# EAGLE design usb4x1mux (EAGLE 7.5.0)
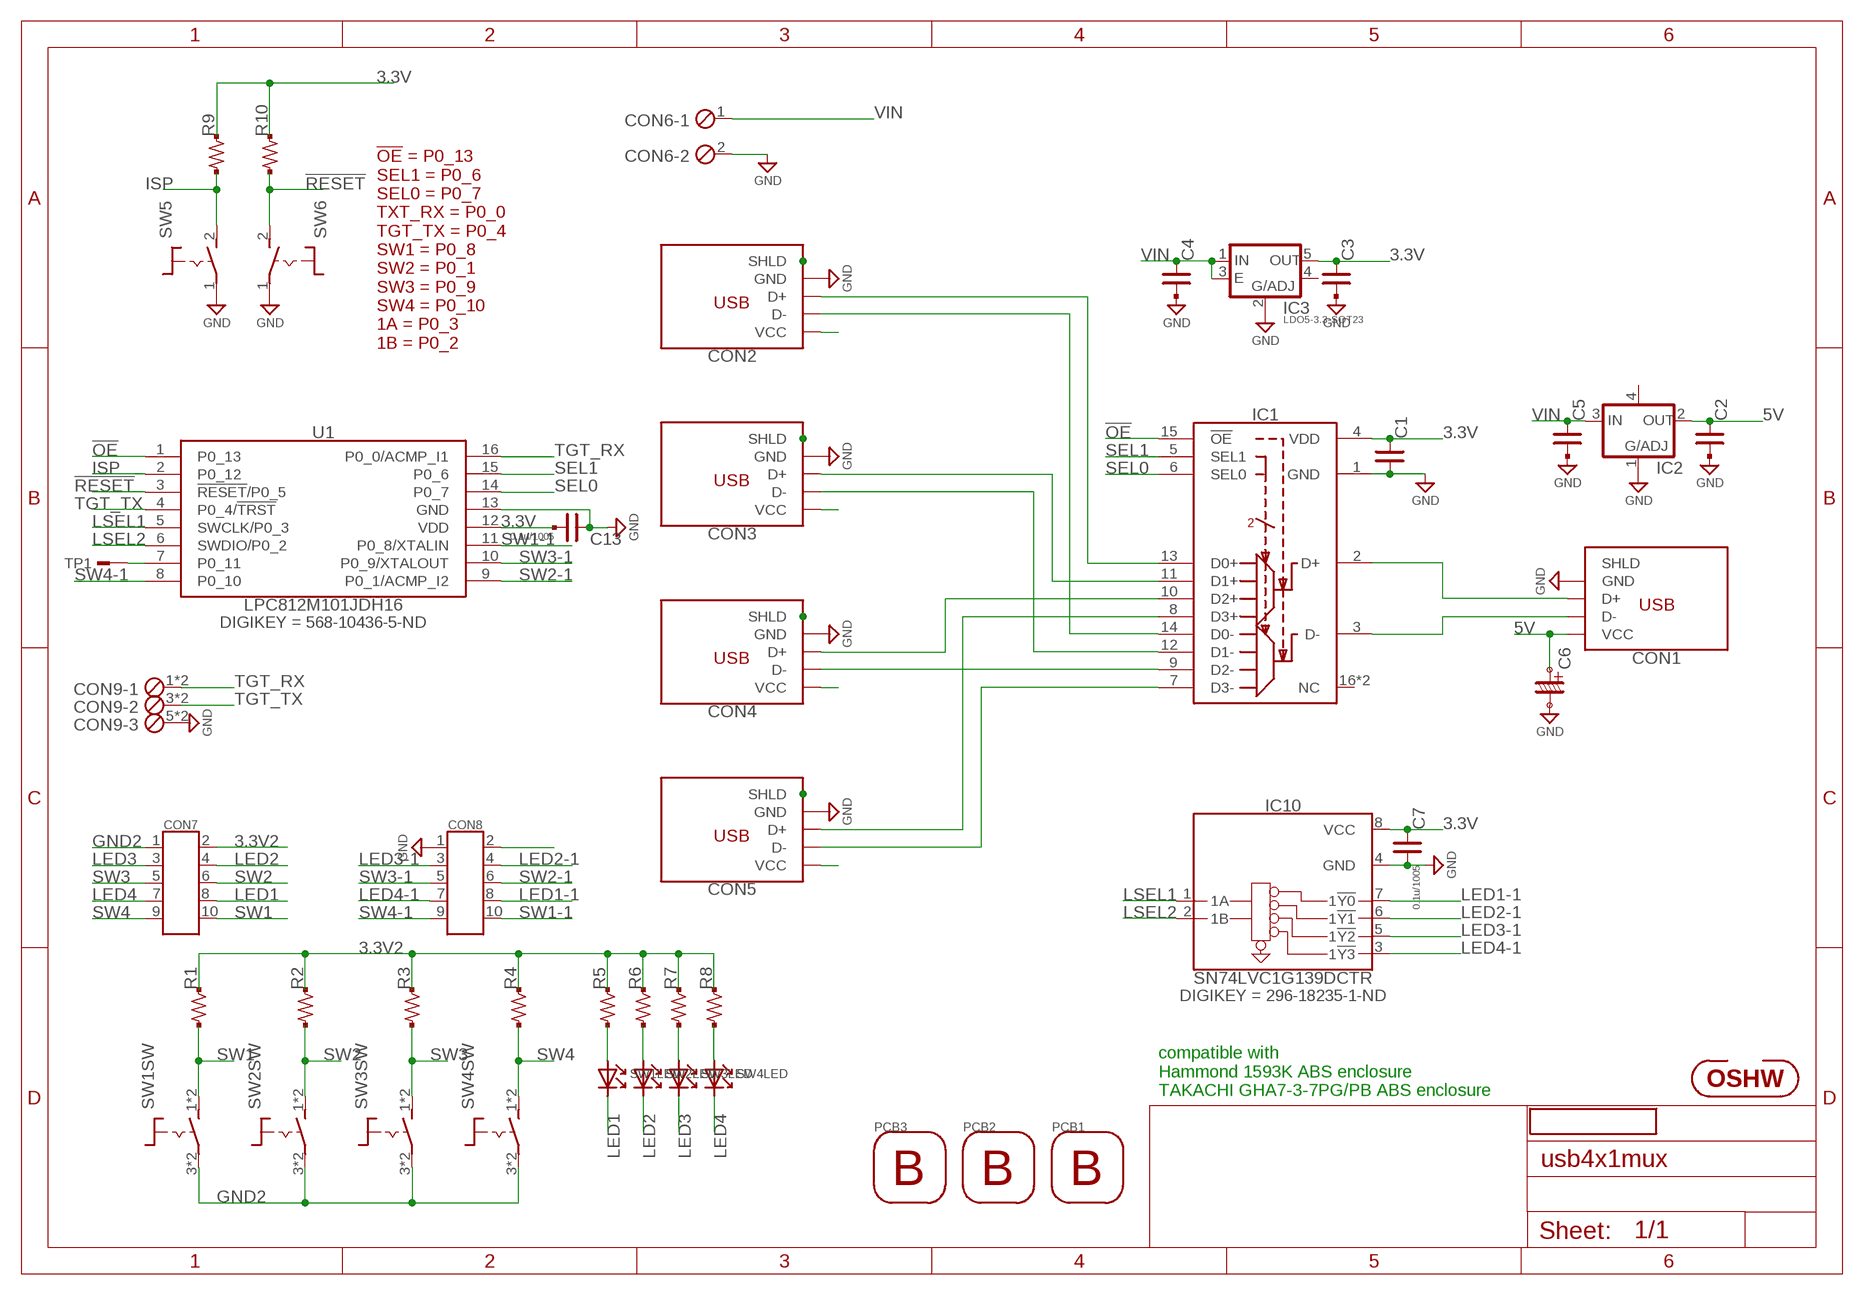
[diagram p0: schematic, sheet 1]

## Parts
C1  C-SMD-0.1U-1608  [CR-1608]
C2  C-SMD-0.1U-1608  [CR-1608]
C3  C-SMD-0.1U-1608  [CR-1608]
C4  C-SMD-10U-1608  [CR-1608]
C5  C-SMD-10U-1608  [CR-1608]
C6  C-DENKAI-100U-875105142005WURTH  [C-2.5PHI5-875105142005WURTH]
C7  0.1u/1005  C-SMD-0.1U-1608  [CR-1608]
C13  0.1u/1005  C-SMD-0.1U-1608  [CR-1608]
CON1  CON-USB-A-614104150121  [CON-USB-614104150121WURTH]
CON2  CON-USB-UB  [CON-USB-47589-0001MOLEX]
CON3  CON-USB-UB  [CON-USB-47589-0001MOLEX]
CON4  CON-USB-UB  [CON-USB-47589-0001MOLEX]
CON5  CON-USB-UB  [CON-USB-47589-0001MOLEX]
CON6  ETB43024B  [ETB43024]
CON7  CON-MIL-10-ARM3  [PH127-2X5MG-1.5]
CON8  CON-MIL-10-ARM3  [PH127-2X5MG-1.5]
CON9  CON-TANSHI3  [CON-FFKV3]
GIT1  GIT-REVISION_1.7  [GIT-REVISION_1.7]
IC1  IC-USB-FSUSB74  [QFN16-0.5P3.0X3.0]
IC2  LDO4-5.0-SOT223  [IC-SOT223]
IC3  LDO5-3.3-SOT23  [SOT95P280X145-5N]
IC10  SN74LVC1G139DCTR  IC-TTL-SINGLE-74-139-FLAT  [SOT65P315X290-8N]
ICON1  ICON-OSHW  [ICON-OSHW]
PCB1  HAMMOND-PCB-BK-1593K  [HAMMOND-1593K]
PCB2  HAMMOND-PCB--66X28  [HAMMOND-1593-28]
PCB3  HAMMOND-PCB--66X28  [HAMMOND-1593-28]
R1  R-US-10K-1608  [R-1608-PADPAD]
R2  R-US-10K-1608  [R-1608-PADPAD]
R3  R-US-10K-1608  [R-1608-PADPAD]
R4  R-US-10K-1608  [R-1608-PADPAD]
R5  R-US-100R-1608  [R-1608-PADPAD]
R6  R-US-100R-1608  [R-1608-PADPAD]
R7  R-US-100R-1608  [R-1608-PADPAD]
R8  R-US-100R-1608  [R-1608-PADPAD]
R9  R-US-100R-1608  [R-1608-PADPAD]
R10  R-US-100R-1608  [R-1608-PADPAD]
SW1  TACTSW2-LED-WH-10SQ  [TS-ALGWRH-G]
SW2  TACTSW2-LED-WH-10SQ  [TS-ALGWRH-G]
SW3  TACTSW2-LED-WH-10SQ  [TS-ALGWRH-G]
SW4  TACTSW2-LED-WH-10SQ  [TS-ALGWRH-G]
SW5  TACTSW2-BK-AKI  [SW-TACTSW-2P]
SW6  TACTSW2-BK-AKI  [SW-TACTSW-2P]
TP1  TESTPAD  [TP06RECT]
U1  LPC812M101JDH16  IC-LPC81X-16-JDH16  [SOT65P510X450X110-16N]

## Nets
3.3V: C1.1 C3.1 C7.1 C13.2 CON8.2 IC1.4(VDD) IC3.5(OUT) IC10.8(VCC) R9.1 R10.1 U1.12(VDD)
3.3V2: CON7.2 R1.1 R2.1 R3.1 R4.1 R5.1 R6.1 R7.1 R8.1
5V: C2.1 C6.+ CON1.1(VCC) IC2.2(OUT)
!OE!: IC1.15(!OE!) U1.1(P0_13)
!RESET!: R10.2 SW6.2(S) U1.3(!RESET!/P0_5)
GND: C1.2 C2.2 C3.2 C4.2 C5.2 C6.- C7.2 C13.1 CON1.4(GND) CON2.5(GND) CON3.5(GND) CON4.5(GND) CON5.5(GND) CON6.2 CON8.1 CON9.5 CON9.6 IC1.1(GND) IC2.1(ADJ) IC3.2(ADJ) IC10.4(GND) SW5.1(P) SW6.1(P) U1.13(GND)
GND2: CON7.1 SW1.3(SW:P) SW1.4(SW:P) SW2.3(SW:P) SW2.4(SW:P) SW3.3(SW:P) SW3.4(SW:P) SW4.3(SW:P) SW4.4(SW:P)
ISP: R9.2 SW5.2(S) U1.2(P0_12)
LED1: CON7.8 SW1.-(LED:K)
LED1-1: CON8.8 IC10.7(1!Y0!)
LED2: CON7.4 SW2.-(LED:K)
LED2-1: CON8.4 IC10.6(1!Y1!)
LED3: CON7.3 SW3.-(LED:K)
LED3-1: CON8.3 IC10.5(1!Y2!)
LED4: CON7.7 SW4.-(LED:K)
LED4-1: CON8.7 IC10.3(1!Y3!)
LSEL1: IC10.1(1A) U1.5(SWCLK/P0_3)
LSEL2: IC10.2(1B) U1.6(SWDIO/P0_2)
N$1: CON2.3(D+) IC1.13(D0+)
N$2: CON2.2(D-) IC1.14(D0-)
N$3: CON3.3(D+) IC1.11(D1+)
N$4: CON3.2(D-) IC1.12(D1-)
N$5: CON4.3(D+) IC1.10(D2+)
N$6: CON4.2(D-) IC1.9(D2-)
N$7: CON5.3(D+) IC1.8(D3+)
N$8: CON5.2(D-) IC1.7(D3-)
N$9: CON1.3(D+) IC1.2(D+)
N$10: CON1.2(D-) IC1.3(D-)
N$11: CON2.1(VCC)
N$12: CON3.1(VCC)
N$13: CON4.1(VCC)
N$14: CON5.1(VCC)
N$15: CON2.SHD$1(SHLD) CON2.SHD$2(SHLD) CON2.SHD$3(SHLD) CON2.SHD$4(SHLD) CON2.SHD$5(SHLD) CON2.SHD$6(SHLD) CON2.SHD$7(SHLD) CON2.SHD(SHLD)
N$16: CON3.SHD$1(SHLD) CON3.SHD$2(SHLD) CON3.SHD$3(SHLD) CON3.SHD$4(SHLD) CON3.SHD$5(SHLD) CON3.SHD$6(SHLD) CON3.SHD$7(SHLD) CON3.SHD(SHLD)
N$17: CON4.SHD$1(SHLD) CON4.SHD$2(SHLD) CON4.SHD$3(SHLD) CON4.SHD$4(SHLD) CON4.SHD$5(SHLD) CON4.SHD$6(SHLD) CON4.SHD$7(SHLD) CON4.SHD(SHLD)
N$18: CON5.SHD$1(SHLD) CON5.SHD$2(SHLD) CON5.SHD$3(SHLD) CON5.SHD$4(SHLD) CON5.SHD$5(SHLD) CON5.SHD$6(SHLD) CON5.SHD$7(SHLD) CON5.SHD(SHLD)
N$23: R5.2 SW1.+(LED:A)
N$24: R6.2 SW2.+(LED:A)
N$25: R7.2 SW3.+(LED:A)
N$26: R8.2 SW4.+(LED:A)
N$69: TP1.TP U1.7(P0_11)
SEL0: IC1.6(SEL0) U1.14(P0_7)
SEL1: IC1.5(SEL1) U1.15(P0_6)
SW1: CON7.10 R1.2 SW1.1(SW:S) SW1.2(SW:S)
SW1-1: CON8.10 U1.11(P0_8/XTALIN)
SW2: CON7.6 R2.2 SW2.1(SW:S) SW2.2(SW:S)
SW2-1: CON8.6 U1.9(P0_1/ACMP_I2)
SW3: CON7.5 R3.2 SW3.1(SW:S) SW3.2(SW:S)
SW3-1: CON8.5 U1.10(P0_9/XTALOUT)
SW4: CON7.9 R4.2 SW4.1(SW:S) SW4.2(SW:S)
SW4-1: CON8.9 U1.8(P0_10)
TGT_RX: CON9.1 CON9.2 U1.16(P0_0/ACMP_I1)
TGT_TX: CON9.3 CON9.4 U1.4(P0_4/!TRST!)
VIN: C4.1 C5.1 CON6.1 IC2.3(IN) IC3.1(IN) IC3.3(E)
Unconnected: CON1.SHLD CON1.SHLD@1(SHLD) IC1.16(NC) IC1.DP(NC) IC2.4(OUT/EN/NC) IC3.4(OUT)

## Notes on the sheet
- !OE! = P0_13
  SEL1 = P0_6
  SEL0 = P0_7
  TXT_RX = P0_0
  TGT_TX = P0_4
  SW1 = P0_8
  SW2 = P0_1
  SW3 = P0_9
  SW4 = P0_10
  1A = P0_3
  1B = P0_2
- compatible with 
  Hammond 1593K ABS enclosure
  TAKACHI GHA7-3-7PG/PB ABS enclosure

## Library data of the parts
C1-C3 C7 C13 = mylib:C-SMD-*: SMD CAPACITOR; AKIZUKI: P-05650; SMD-PAD: 2
C4 C5 = mylib:C-SMD-*: SMD CAPACITOR; DIGIKEY: 445-11238-1-ND; SMD-PAD: 2
C6 = mylib:C-DENKAI-*: Chemical capacitor; DIGIKEY: 732-6394-1-ND; SMD-PAD: 2
CON1 = mylib:CON-USB: USB B CONNECTOR; DIGIKEY: 732-5962-1-ND; MOUSER: 710-614104150121; TH-PAD: 6
CON2-CON5 = mylib:CON-USB: USB B CONNECTOR; DIGIKEY: WM17143CT-ND; SMD-PAD: 11
CON6 = mylib:ETB43024*; AKIZUKI: P-11589
CON7 CON8 = mylib:CON-MIL-10: MIL Box Pinheader : 10Pin; AKIZUKI: C-10904
CON9 = mylib:CON-TANSHI3
GIT1 = git-revision:GIT-REVISION; NOT_COMPONENT: YES
IC1 = mylib:IC-USB-FSUSB74: 4 to 1 USB switch; DIGIKEY: FSUSB74MPXCT-ND; SMD-PAD: 17
IC2 = mylib:LDO4-*: LDO with 4 pins; DIGIKEY: AZ1117EH-5.0TRG1DICT-ND
IC3 = mylib:LDO5-*; AKIZUKI: I-05448; DIGIKEY: 296-35483-1-ND
IC10 = mylib:IC-TTL-SINGLE-74-139: single 74 logic IC: 139; DIGIKEY: 296-18235-1-ND; SMD-PAD: 8
ICON1 = mylib:ICON-OSHW: Silk icon of OSHW; NOT-COMPONENT: YES
PCB1-PCB3 = mylib:HAMMOND-PCB-*
R1-R10 = mylib:R-US-*: SMD resistor Packages : -1608 : 1.6 x 0.8 mm -2125 : 2.0 x 1.25 mm -3216 : 3.2 x 1.6 mm
SW1-SW4 = mylib:TACTSW2-LED-*; AKIZUKI: P-12722
SW5 SW6 = mylib:TACTSW2-*: 2P tact switch; AKIZUKI: P-08078; TH-PAD: 2
TP1 = mylib:TESTPAD: test points; NOT-COMPONENT: YES
U1 = mylib:IC-LPC81X-16: LPC81X microcontroller; DIGIKEY: 568-10436-5-ND; SMD-PAD: 16

## Board
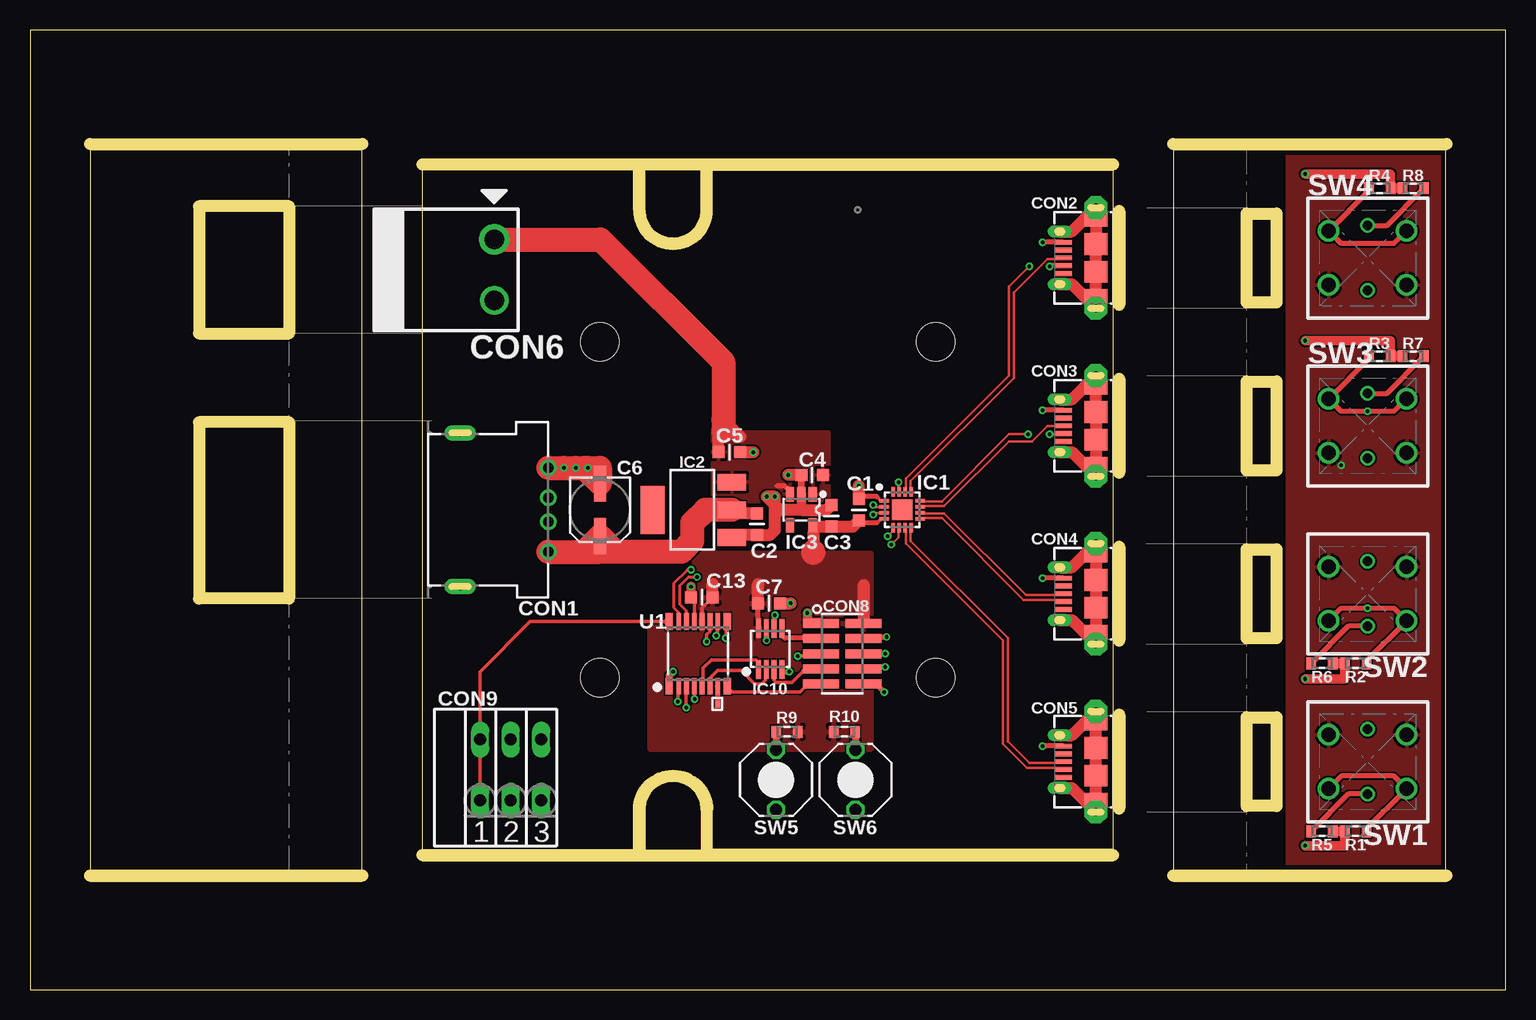
[diagram p1: board, top side]
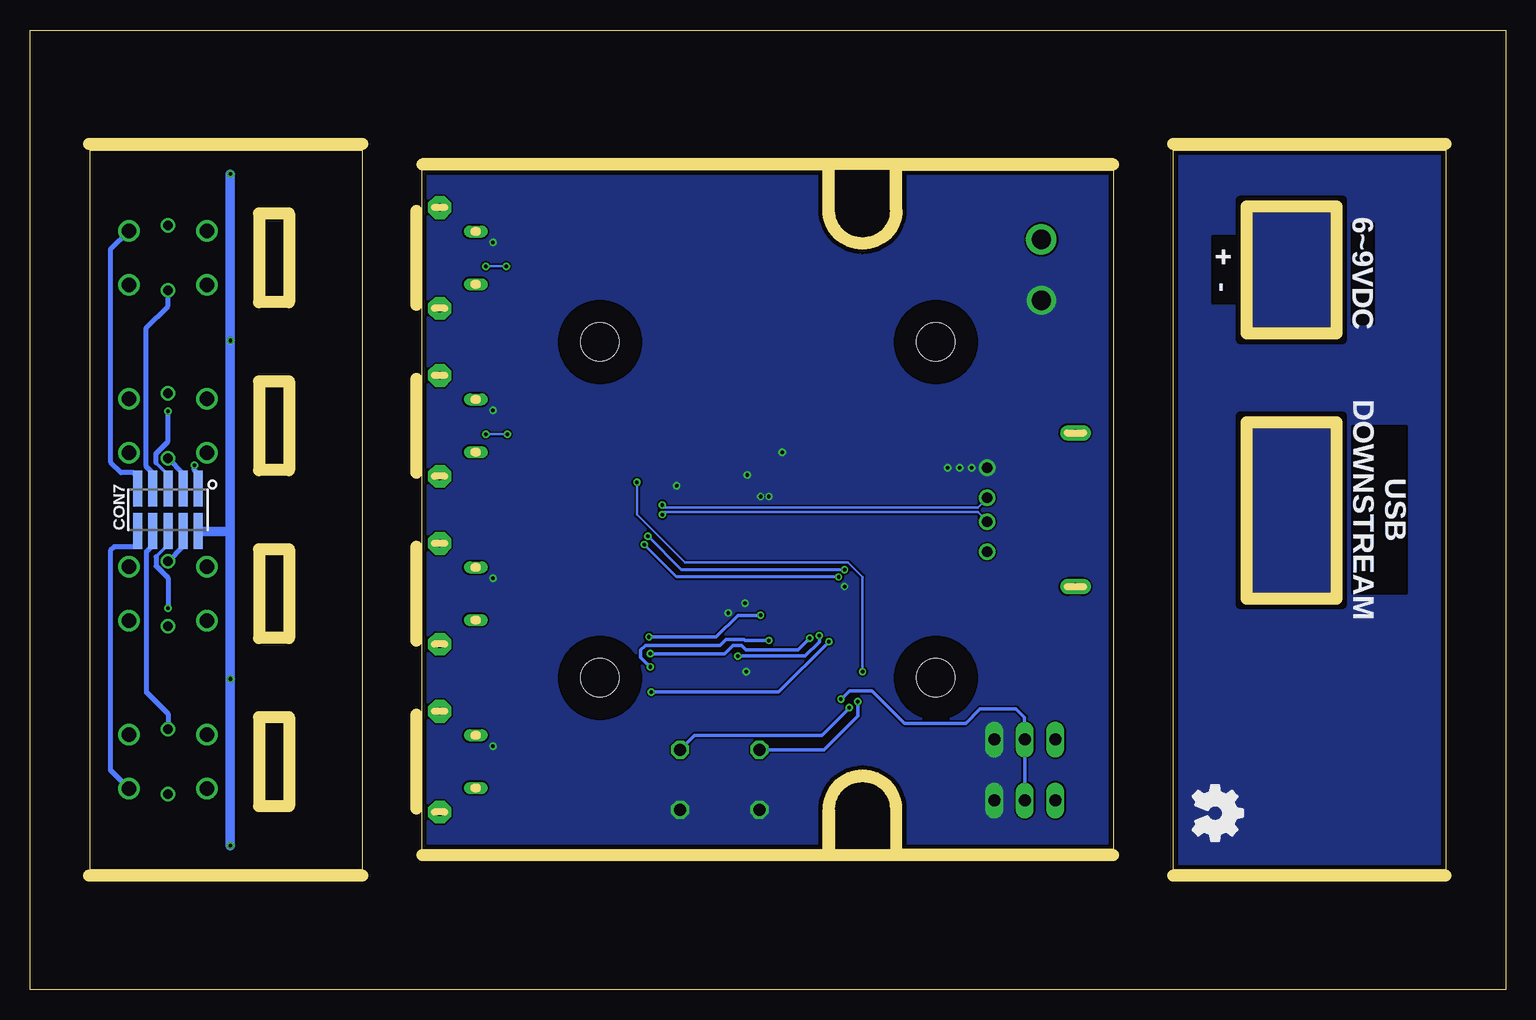
[diagram p2: board, bottom side, seen from below]

Size 123 x 80 mm. Coordinates in mm from the lower left corner, seen from the top.
Outline: 0,0 123,0 123,80 0,80 0,0
Copper layers (1*16): Top 0.035mm / dielectric 1.5mm / Bottom 0.035mm
Design rules "default": minimum track width 0.15mm, minimum drill 0.3mm, track to track 0.15mm, track to pad 0.15mm, pad to pad 0.15mm, via to via 0.15mm, smd to smd 0mil, copper to edge 0.4mm, drill to drill 8mil, minimum pad ring 0.15mm, minimum via ring 0.15mm, stop-mask expansion 4mil, vias tented up to drill 100mil, thermal gap 10mil
bRestrict: 8 lines
Milling: 44 lines

### Footprints (pad centres in the part's own frame; a part is rotated, then mirrored left to right if it is on the bottom)
CR-1608 = smd 1 x 1: 1 -0.9,0; 2 0.9,0
C-2.5PHI5-875105142005WURTH = smd 1 x 3: + 0,-2.2; - 0,2.2
CON-USB-614104150121WURTH = drill 0.9: 1 3.5,0; 2 1,0; 3 -1,0; 4 -3.5,0 | drill 0.6 pad 1.3 long: SHLD -6.4,-7.35; SHLD@1 6.4,-7.35
CON-USB-47589-0001MOLEX = smd 0.4 x 1.4: 1 -1.3,4.15; 2 -0.65,4.15; 3 0,4.15; 4 0.65,4.15; 5 1.3,4.15 | drill 0.6 pad 1 long: SHD -2.2,4.45; SHD$1 2.2,4.45 | drill 0.6 pad 1.9 octagon: SHD$2 -4.2,1.45; SHD$3 4.2,1.45 | smd 1.6 x 1.9: SHD$4 -3.4,1.45; SHD$7 3.4,1.45 | smd 1.8 x 1.9: SHD$5 -1.15,1.45; SHD$6 1.15,1.45
ETB43024 = drill 1.6 pad 2.54: 1 -2.54,0 | drill 1.6: 2 2.54,0
PH127-2X5MG-1.5 = smd 0.75 x 3: 1 -2.54,-1.778; 2 -2.54,1.778; 3 -1.27,-1.778; 4 -1.27,1.778; 5 0,-1.778; 6 0,1.778; 7 1.27,-1.778; 8 1.27,1.778; 9 2.54,-1.778; 10 2.54,1.778
CON-FFKV3 = drill 0.991 long: 1 -1.27,2.54; 2 -1.27,-2.54; 3 1.27,2.54; 4 1.27,-2.54; 5 3.81,2.54; 6 3.81,-2.54
QFN16-0.5P3.0X3.0 = smd 0.8 x 0.3: 1 -1.5,0.75; 2 -1.5,0.25; 3 -1.5,-0.25; 4 -1.5,-0.75; 9 1.5,-0.75; 10 1.5,-0.25; 11 1.5,0.25; 12 1.5,0.75 | smd 0.3 x 0.8: 5 -0.75,-1.5; 6 -0.25,-1.5; 7 0.25,-1.5; 8 0.75,-1.5; 13 0.75,1.5; 14 0.25,1.5; 15 -0.25,1.5; 16 -0.75,1.5 | smd 1.7 x 1.7: DP 0,0
IC-SOT223 = smd 1.4 x 2.4: 1 -2.3,-3.3; 2 0,-3.3; 3 2.3,-3.3 | smd 4 x 2: 4 0,3.3
SOT95P280X145-5N = smd 1.2 x 0.7: 1 -1.3,0.95; 2 -1.3,0; 3 -1.3,-0.95; 4 1.3,-0.95; 5 1.3,0.95
SOT65P315X290-8N = smd 0.4 x 1.6: 1 -0.975,-1.7; 2 -0.325,-1.7; 3 0.325,-1.7; 4 0.975,-1.7; 5 0.975,1.7; 6 0.325,1.7; 7 -0.325,1.7; 8 -0.975,1.7
HAMMOND-1593K = hole 3.2: 14.8,42.3; 42.8,42.3; 14.8,14.3; 42.8,14.3
R-1608-PADPAD = smd 0.8 x 1: 1 -0.9,0; 2 0.9,0
TS-ALGWRH-G = drill 1.2: 1 -3.25,2.25; 2 3.25,2.25; 3 -3.25,-2.25; 4 3.25,-2.25 | drill 0.8: + 0,2.7; - 0,-2.7
SW-TACTSW-2P = drill 1 octagon: 1 -2.5,0; 2 2.5,0
TP06RECT = smd 0.4 x 0.6: TP 0,0
SOT65P510X450X110-16N = smd 0.6 x 1.4: 1 -2.425,-2.7; 8 2.425,-2.7; 9 2.425,2.7; 16 -2.425,2.7 | smd 0.4 x 1.4: 2 -1.625,-2.7; 3 -0.975,-2.7; 4 -0.325,-2.7; 5 0.325,-2.7; 6 0.975,-2.7; 7 1.625,-2.7; 10 1.625,2.7; 11 0.975,2.7; 12 0.325,2.7; 13 -0.325,2.7; 14 -0.975,2.7; 15 -1.625,2.7

### Placement (x,y rotation side)
C1  69.1,40 90 top
C2  60.6,38.8 270 top
C3  66.8,39.5 90 top
C4  65.2,42.9 180 top
C5  58.3,44.8 0 top
C6  47.5,40 0 top
C7  61.6,32.2 0 top
C13  56,32.7 0 top
CON1  43.2,40 270 top
CON2  90.3,61 90 top
CON3  90.3,47 90 top
CON4  90.3,33 90 top
CON5  90.3,19 90 top
CON6  38.7,60 270 top
CON7  111.5,40 180 bottom
CON8  67.7,28 270 top
CON9  38.8,18.3 0 top
GIT1  69,65 0 top
IC1  72.7,40 0 top
IC2  55.2,40 90 top
IC3  64.3,40 270 top
IC10  61.7,28.4 0 top
ICON1  24.2,14.7 270 bottom
PCB1  32.7,11.7 0 top
PCB2  95.3,70 270 top
PCB3  27.7,10 90 top
R1  110.5,13.2 0 top
R2  110.5,27.2 0 top
R3  112.5,52.8 180 top
R4  112.5,66.8 180 top
R5  107.7,13.2 180 top
R6  107.7,27.2 180 top
R7  115.3,52.8 0 top
R8  115.3,66.8 0 top
R9  63.1,21.5 180 top
R10  67.9,21.5 0 top
SW1  111.5,19 180 top
SW2  111.5,33 180 top
SW3  111.5,47 0 top
SW4  111.5,61 0 top
SW5  62.2,17.5 90 top
SW6  68.8,17.5 90 top
TP1  57.3,23.8 0 top
U1  55.7,28 0 top

### Tracks (layer width: path | path; a pad name or v marks a point on that pad's centre or on a via)
3.3V
  Top 0.3: IC1.4 70.95,39.25 70.6,38.9 | U1.12 56.02,31.82 C13.2
  Top 0.4: 70.6,38.9 69.3,38.9 C1.1 | IC10.8 60.73,30.88 60.7,30.9 C7.1
  Top 0.6: IC3.5 65.25,38.65 | 65.25,38.65 65.3,38.6 65.5,38.6 | 65.25,38.65 65.25,38.45 65.3,38.4 65.3,38
  Top 0.8: CON8.2 69.48,30.58 69.5,30.6 69.5,30.8
  Top 1: C1.1 68.6,38.6 C3.1 65.5,38.6 | C13.2 56.9,33.8 | C7.1 60.7,33.8 | 69.5,30.8 69.5,33.7 | 65.3,38 65.3,36.5
  Top 2: 65.3,36.5 65.3,36.4
  pour Top: 51.7,20 51.7,36.4 70.1,36.4 70.1,20
3.3V2  (via drill 0.3)
  Top 0.8: R6.1 R2.1 109.6,25.9 v106.3,25.9 | v106.3,12 109.6,12 R1.1 R5.1 | v106.3,54.1 113.4,54.1 R3.1 R7.1 | R8.1 R4.1 113.4,68 v106.3,68
  Bottom 0.8: 106.3,38.2 v106.3,54.1 v106.3,68 | 106.3,38.2 v106.3,25.9 v106.3,12 | CON7.2 108.92,38.22 108.9,38.2 106.3,38.2
5V
  Top 1: 47.5,36.5 C6.+ | C2.1 58.8,39.7 IC2.2
  Top 2: CON1.1 46.2,36.5 | 46.2,36.5 C6.+ 48.8,36.5 | 46.2,36.5 47.5,36.5 48.8,36.5 | IC2.2 56.3,40 55.2,38.9 55.2,37.4 54.3,36.5 48.8,36.5
!OE!  (via drill 0.3)
  Top 0.2: IC1.15 72.45,41.75 72.4,41.8 v72.4,42.3 | U1.1 53.3,25.3 53.3,25.7
  Top 0.6: 53.3,25.7 53.3,26.2 v53.6,26.5
  Bottom 0.2: v72.4,42.3 72.4,39.6 68.4,35.6 54.8,35.6 53.6,34.4 v53.6,26.5
!RESET!  (via drill 0.3)
  Top 0.3: U1.3 54.7,25.3 v54.7,23.5
  Top 0.6: R10.2 SW6.2
  Bottom 0.3: v54.7,23.5 57,21.2 67.6,21.2 SW6.2
GND  (via drill 0.3)
  Top 0.3: IC1.1 70.95,40.75 70.6,41.1 | U1.13 55.38,32.42 C13.1
  Top 0.4: 70.6,41.1 69.3,41.1 C1.2 | CON5.5 v84.4,20.3 | CON4.5 v84.4,34.3 | CON3.5 v84.4,48.3 | CON2.5 v84.4,62.3 | IC10.4 62.67,26.52 62.7,26.5 v63.3,26.5
  Top 0.6: IC3.2 C4.2
  Top 0.8: IC3.2 64.3,40 | C13.1 v55.1,33.6 | v64.8,31.4 64.8,30.6 65.9,30.6 65.92,30.58 CON8.1
  Top 1: C5.2 v60.3,44.8 | C4.2 v63.2,42.9 | C1.2 v69.1,42 | IC2.1 58.7,37.9 C2.2 61.7,37.9 62.1,38.3 62.1,39.6 | 62.5,40 64.3,40 66.4,40 C3.2 | 62.5,40 62.1,39.6 | 62.1,39.6 62.1,40.4 | 62.5,40 62.1,40.4 | 62.1,40.4 v61.4,41.1 v62.1,41.1 62.1,40.4 | C7.2 v63.4,32.2
  Top 2: CON1.4 v44.5,43.5 v45.5,43.5 46.2,43.5 | 46.2,43.5 C6.- 47.5,43.5 v46.5,43.5 46.2,43.5
  pour Bottom (no thermals): 32.7,68.3 90.3,68.3 90.3,11.7 32.7,11.7
GND2  (via drill 0.3)
  Bottom 0.4: CON7.1 108.96,42.96 109.3,43.3 v109.3,43.7
  pour Top: 118,10 104.8,10 104.8,70 118,70
ISP  (via drill 0.3)
  Top 0.3: U1.2 54,25.3 v54,24
  Top 0.6: R9.2 SW5.2
  Bottom 0.3: v54,24 54,22.8 56.8,20 SW5.2
LED1
  Bottom 0.4: CON7.8 112.77,39.33 112.8,39.3 112.8,37 113.3,36.5 113.3,24.8 111.5,23 SW1.-
LED1-1  (via drill 0.3)
  Top 0.3: IC10.7 61.38,29.52 61.4,29.5 v61.4,29.1
  Top 0.4: CON8.8 69.48,26.88 69.5,26.9 v71.3,26.9
  Bottom 0.3: v61.4,29.1 63.4,29.1 63.5,29.2 65,29.2 65.5,28.7 71.7,28.7 72.1,28.3 72.1,27.7 v71.3,26.9
LED2
  Bottom 0.4: SW2.- 110.3,36.9 110.3,38.2 110.28,38.22 CON7.4
LED2-1  (via drill 0.3)
  Top 0.3: v62.1,31.2 62.1,30.18 IC10.6
  Top 0.4: CON8.4 69.48,29.38 69.5,29.4 v71.4,29.4
  Bottom 0.3: v71.4,29.4 65.8,29.4 64,31.2 v62.1,31.2
LED3
  Bottom 0.4: CON7.3 110.23,40.63 110.2,40.6 110.2,43 SW3.-
LED3-1
  Top 0.4: CON8.3 65.9,29.3 62.9,29.3 62.7,29.5 62.7,30.1 IC10.5
LED4
  Bottom 0.4: SW4.- 111.5,57 113.3,55.2 113.3,43.6 112.8,43.1 112.8,41.8 CON7.7
LED4-1
  Top 0.3: 64.5,26.6 63.5,25.6 62.2,25.6 62,25.8 62,26.7 IC10.3
  Top 0.4: CON8.7 65.92,26.62 65.9,26.6 64.5,26.6
LSEL1
  Top 0.3: U1.5 56.1,25.3 56.1,26.8 56.8,27.5 60.5,27.5 60.7,27.3 60.7,26.7 IC10.1
LSEL2
  Top 0.3: IC10.2 61.3,26.7 61.3,25.8 61,25.5 60.4,25.5 59.3,26.6 57.3,26.6 56.7,26 56.7,25.3 U1.6
N$1
  Top 0.2: IC1.13 73.45,41.75 73.4,41.8 73.4,42.4 82,51 82,58.1 84.8,60.9 86,60.9 86.1,61 CON2.3
N$2  (via drill 0.3)
  Top 0.2: IC1.14 72.95,41.75 73,41.8 73,42.6 81.6,51.2 81.6,58.6 v83.3,60.3 | CON2.2 86,60.5 85.2,60.5 v85,60.3
  Bottom 0.2: v85,60.3 v83.3,60.3
N$3
  Top 0.2: CON3.3 84.8,47 83.5,45.7 81.6,45.7 76.2,40.3 74.5,40.3 74.45,40.25 IC1.11
N$4  (via drill 0.3)
  Top 0.2: CON3.2 86.1,46.3 v85,46.3 | v83.2,46.3 81.6,46.3 76,40.7 74.5,40.7 74.45,40.75 IC1.12
  Bottom 0.2: v85,46.3 v83.2,46.3
N$5
  Top 0.2: IC1.10 74.45,39.75 74.5,39.7 76.2,39.7 83,32.9 86,32.9 86.1,33 CON4.3
N$6
  Top 0.2: IC1.9 74.45,39.25 74.5,39.3 76,39.3 82.8,32.5 86,32.5 CON4.2
N$7
  Top 0.2: IC1.8 73.45,38.25 73.4,38.2 73.4,37.4 81.5,29.3 81.5,20.7 83.3,18.9 86,18.9 86.1,19 CON5.3
N$8
  Top 0.2: IC1.7 72.95,38.25 73,38.2 73,37.2 81.1,29.1 81.1,20.5 83.1,18.5 86,18.5 CON5.2
N$9  (via drill 0.3)
  Top 0.2: IC1.2 70.45,40.25 v70.3,40.4
  Bottom 0.2: v70.3,40.4 70.1,40.2 44,40.2 CON1.3
N$10  (via drill 0.3)
  Top 0.2: IC1.3 70.45,39.75 v70.3,39.6
  Bottom 0.2: v70.3,39.6 70.1,39.8 44,39.8 CON1.2
N$15
  Top 1: CON2.SHD$1 86.85,63.2 CON2.SHD$3 CON2.SHD$7 CON2.SHD$6 CON2.SHD$5 CON2.SHD$4 CON2.SHD$2 86.85,58.8 CON2.SHD
N$16
  Top 1: CON3.SHD 86.85,44.8 CON3.SHD$2 CON3.SHD$4 CON3.SHD$5 CON3.SHD$6 CON3.SHD$7 CON3.SHD$3 86.85,49.2 CON3.SHD$1
N$17
  Top 1: CON4.SHD 86.85,30.8 CON4.SHD$2 CON4.SHD$4 CON4.SHD$5 CON4.SHD$6 CON4.SHD$7 CON4.SHD$3 86.85,35.2 CON4.SHD$1
N$18
  Top 1: CON5.SHD$1 86.85,21.2 CON5.SHD$3 CON5.SHD$7 CON5.SHD$6 CON5.SHD$5 CON5.SHD$4 CON5.SHD$2 86.85,16.8 CON5.SHD
N$19
  pour Bottom: 5,70 27.7,70 27.7,10 5,10
N$23
  Top 0.4: SW1.+ 109.9,16.3 R5.2
N$24
  Top 0.4: SW2.+ 109.9,30.3 R6.2
N$25
  Top 0.4: SW3.+ 113.1,49.7 R7.2
N$26
  Top 0.4: SW4.+ 113.1,63.7 R8.2
N$69
  Top 0.4: U1.7 57.3,25.3 TP1.TP
SEL0  (via drill 0.3)
  Top 0.2: IC1.6 72.4,38.5 72.4,37.7 v71.8,37.1
  Top 0.25: U1.14 54.73,31.57 54.2,32.1 54.2,33.7 54.9,34.4 v55.6,34.4
  Bottom 0.25: v55.6,34.4 69.1,34.4 v71.8,37.1
SEL1  (via drill 0.3)
  Top 0.2: IC1.5 71.9,38.5 71.9,38.2 v71.5,37.8
  Top 0.25: U1.15 54.08,31.43 53.7,31.8 53.7,33.9 54.8,35 v55.1,35
  Bottom 0.25: v55.1,35 68.7,35 v71.5,37.8
SW1
  Top 0.4: SW1.2 109.3,17.8 113.7,17.8 SW1.1 111.4,13.4 R1.2
  Bottom 0.4: CON7.10 114.06,39.37 114.1,39.4 114.1,37.2 114.4,36.9 116,36.9 116.3,36.6 116.3,18.3 SW1.1
SW1-1  (via drill 0.3)
  Top 0.3: U1.11 56.67,29.88 56.4,29.6 v56.4,29
  Top 0.4: CON8.10 69.48,25.32 69.5,25.3 70.7,25.3 v71.2,24.8
  Bottom 0.3: v71.2,24.8 60.6,24.8 v56.4,29
SW2  (via drill 0.3)
  Top 0.4: R2.2 111.4,27.4 SW2.1 113.7,31.8 v111.5,31.8 109.3,31.8 SW2.2
  Bottom 0.3: 111.5,37.1 112.5,36.1
  Bottom 0.4: CON7.6 111.5,37.1 | 112.5,36.1 112.5,35.3 111.5,34.3 v111.5,31.8
SW2-1  (via drill 0.3)
  Top 0.3: U1.9 58.12,30.32 58,30.2 v58,29.3
  Top 0.4: CON8.6 v71.3,28
  Bottom 0.3: v71.3,28 65.1,28 64.4,28.7 63.7,28.7 63.3,28.3 59,28.3 v58,29.3
SW3  (via drill 0.3)
  Top 0.4: R3.2 111.6,52.6 SW3.1 109.3,48.2 v111.5,48.2 113.7,48.2 SW3.2
  Bottom 0.3: 111.5,42.9 112.5,43.9
  Bottom 0.4: 112.5,43.9 112.5,44.7 111.5,45.7 v111.5,48.2 | CON7.5 111.5,42.9
SW3-1  (via drill 0.3)
  Top 0.3: U1.10 57.33,29.62 v57.2,29.5 | CON8.5 65.92,27.82 65.9,27.8 v64,27.8
  Bottom 0.3: v64,27.8 58.4,27.8 57.2,29 v57.2,29.5
SW4
  Top 0.4: R4.2 111.6,66.6 SW4.1 109.3,62.2 113.7,62.2 SW4.2
  Bottom 0.4: CON7.9 114.02,41.78 114,41.8 114,42.7 114.4,43.1 115.4,43.1 116.3,44 116.3,61.7 SW4.2
SW4-1
  Top 0.3: 64.7,25.3 64.2,24.8 58.5,24.8 | 58.5,24.8 58.2,24.8 58.2,25.1 | 58.2,25.1 58.2,25.23 U1.8 | 58.5,24.8 58.2,25.1
  Top 0.4: CON8.9 65.92,25.32 65.9,25.3 64.7,25.3
TGT_RX
  Top 0.3: U1.16 52.9,30.7 | 52.9,30.7 41.7,30.7 37.5,26.5 37.5,20.9 37.53,20.87 CON9.1 CON9.2 | 52.9,30.7 53.2,31 | 52.9,30.7 53.2,30.4
TGT_TX  (via drill 0.3)
  Top 0.3: U1.4 55.4,25.3 v55.4,24.2
  Bottom 0.3: v55.4,24.2 54.7,24.9 52.8,24.9 50.1,22.2 45,22.2 43.8,23.4 40.8,23.4 40.1,22.7 40.1,20.9 40.07,20.87 CON9.3 CON9.4
VIN
  Top 0.4: IC3.3 63.3,41.3 63.3,41.6 62.9,42 62.3,42
  Top 1: C5.1 57.4,46.2 57.8,46.6 | 57.8,47.5 59.2,46.1
  Top 2: CON6.1 47.56,62.54 57.8,52.3 57.8,47.5 57.8,46.6
  pour Top: 56.9,46.5 66.6,46.5 66.6,40.7 56.9,40.7

### Text on the board
Bottom: 6~9VDC | + - | USB / DOWNSTREAM
bPlace: 6~9VDC | + - | USB / DOWNSTREAM
Measures: h=8.6 | h=7.85
tDocu: h=7.5
Vscore: v-CUT | v-CUT | v-CUT | v-CUT | v-CUT | v-CUT